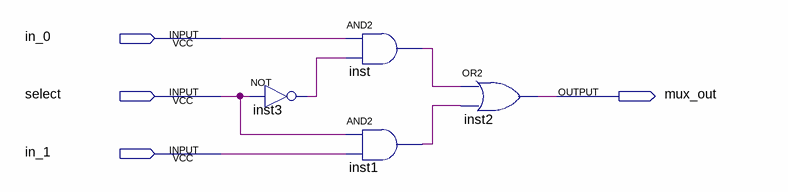
[diagram p0: schematic sheet]
// Quartus schematic mux2to1.bdf as structural Verilog: 4 symbols, 4 pins
module mux2to1 (
  input  in_0,
  input  select,
  input  in_1,
  output mux_out
);

  wire inst1_out, inst3_out, inst_out;

  not inst3 (inst3_out, select);
  and inst (inst_out, in_0, inst3_out);
  and inst1 (inst1_out, select, in_1);
  or inst2 (mux_out, inst_out, inst1_out);
endmodule
